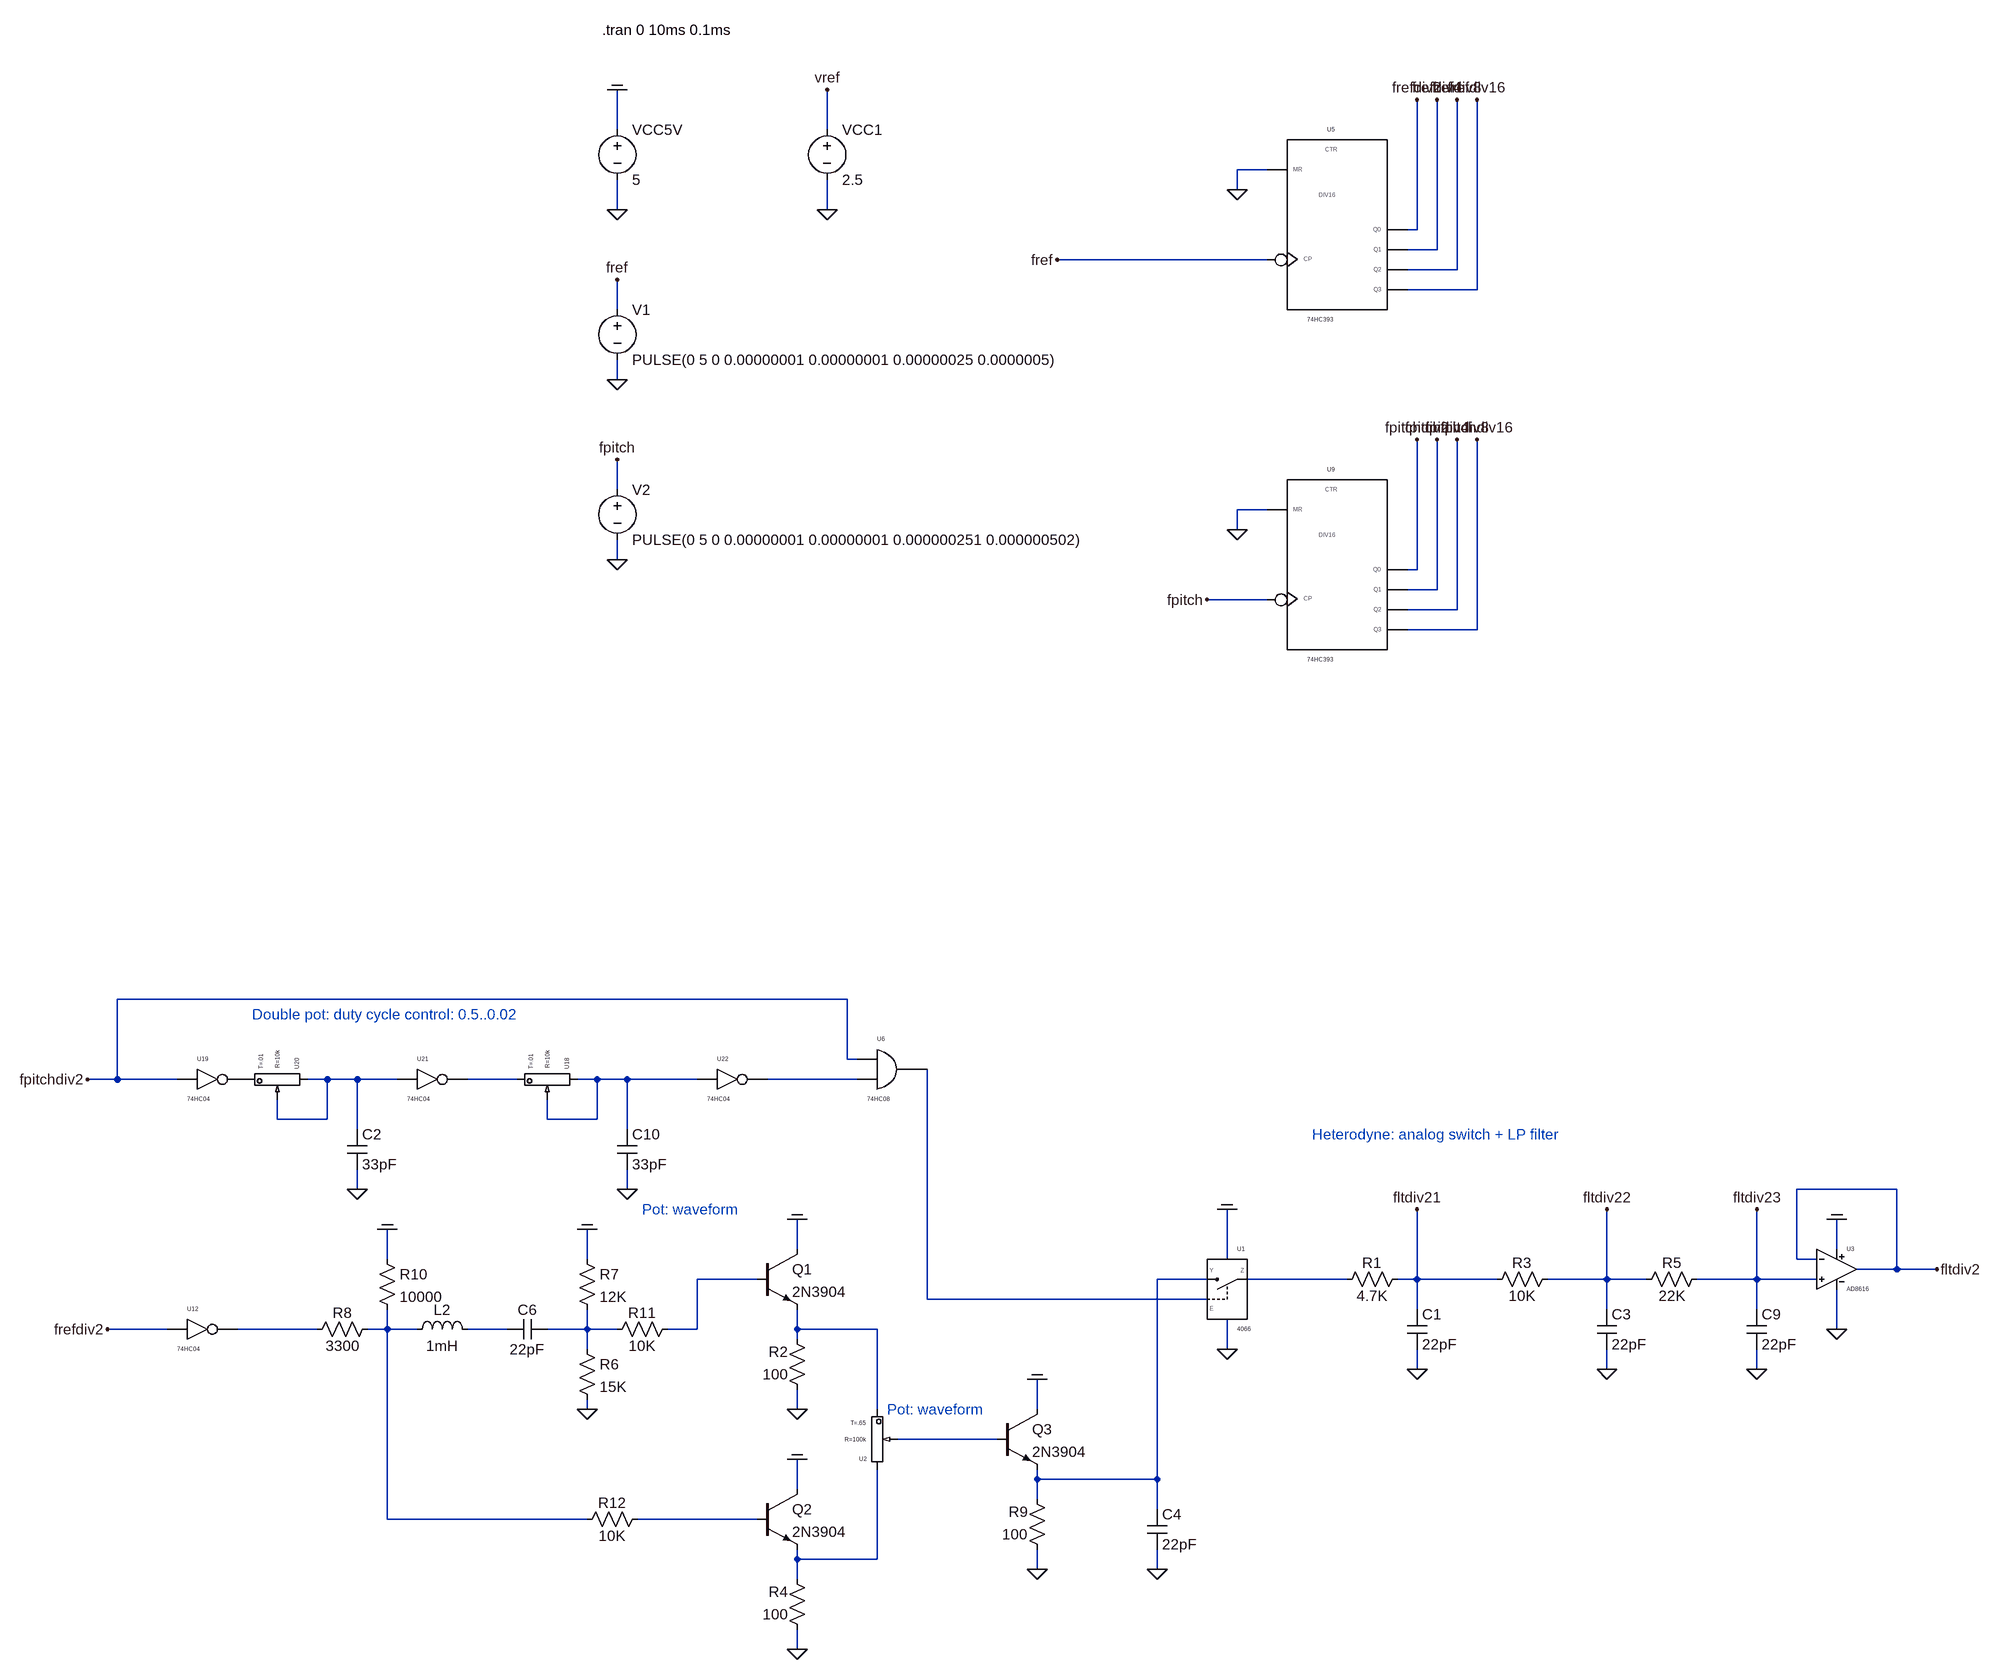
[diagram p0: schematic paradox_mixer_v1.asc]
paradox_mixer_v1.asc, the LTspice schematic file:
Version 4
SHEET 1 880 1476
WIRE -4336 -1264 -4336 -1328
WIRE -4000 -1264 -4000 -1328
WIRE -3296 -1200 -3344 -1200
WIRE -3344 -1168 -3344 -1200
WIRE -4336 -1136 -4336 -1184
WIRE -4000 -1136 -4000 -1184
WIRE -3056 -1104 -3056 -1312
WIRE -3056 -1104 -3072 -1104
WIRE -3024 -1072 -3024 -1312
WIRE -3024 -1072 -3072 -1072
WIRE -3296 -1056 -3632 -1056
WIRE -2992 -1040 -2992 -1312
WIRE -2992 -1040 -3072 -1040
WIRE -2960 -1008 -2960 -1312
WIRE -2960 -1008 -3072 -1008
WIRE -4336 -976 -4336 -1024
WIRE -4336 -864 -4336 -896
WIRE -4336 -688 -4336 -736
WIRE -3296 -656 -3344 -656
WIRE -3344 -624 -3344 -656
WIRE -4336 -576 -4336 -608
WIRE -3056 -560 -3056 -768
WIRE -3056 -560 -3072 -560
WIRE -3024 -528 -3024 -768
WIRE -3024 -528 -3072 -528
WIRE -3296 -512 -3392 -512
WIRE -2992 -496 -2992 -768
WIRE -2992 -496 -3072 -496
WIRE -2960 -464 -2960 -768
WIRE -2960 -464 -3072 -464
WIRE -3968 128 -5136 128
WIRE -3968 224 -3968 128
WIRE -3952 224 -3968 224
WIRE -5136 256 -5136 128
WIRE -5136 256 -5184 256
WIRE -5040 256 -5136 256
WIRE -4800 256 -4832 256
WIRE -4752 256 -4800 256
WIRE -4688 256 -4752 256
WIRE -4496 256 -4576 256
WIRE -4368 256 -4400 256
WIRE -4320 256 -4368 256
WIRE -4208 256 -4320 256
WIRE -3952 256 -4096 256
WIRE -4880 320 -4880 288
WIRE -4800 320 -4800 256
WIRE -4800 320 -4880 320
WIRE -4448 320 -4448 288
WIRE -4368 320 -4368 256
WIRE -4368 320 -4448 320
WIRE -4752 336 -4752 256
WIRE -4320 336 -4320 256
WIRE -4752 432 -4752 400
WIRE -4320 432 -4320 400
WIRE -2288 432 -2448 432
WIRE -4048 528 -4048 480
WIRE -2384 528 -2384 480
WIRE -4704 544 -4704 496
WIRE -4384 544 -4384 496
WIRE -3360 544 -3360 464
WIRE -2448 544 -2448 432
WIRE -2416 544 -2448 544
WIRE -2288 560 -2288 432
WIRE -2288 560 -2352 560
WIRE -2224 560 -2288 560
WIRE -4112 576 -4208 576
WIRE -3392 576 -3472 576
WIRE -3168 576 -3328 576
WIRE -3056 576 -3056 464
WIRE -3056 576 -3088 576
WIRE -2928 576 -3056 576
WIRE -2752 576 -2752 464
WIRE -2752 576 -2848 576
WIRE -2688 576 -2752 576
WIRE -2512 576 -2512 464
WIRE -2512 576 -2608 576
WIRE -2416 576 -2512 576
WIRE -3840 608 -3840 240
WIRE -3392 608 -3840 608
WIRE -3056 624 -3056 576
WIRE -2752 624 -2752 576
WIRE -2512 624 -2512 576
WIRE -5056 656 -5152 656
WIRE -4816 656 -4944 656
WIRE -4704 656 -4704 624
WIRE -4704 656 -4736 656
WIRE -4656 656 -4704 656
WIRE -4512 656 -4576 656
WIRE -4384 656 -4384 624
WIRE -4384 656 -4448 656
WIRE -4336 656 -4384 656
WIRE -4208 656 -4208 576
WIRE -4208 656 -4256 656
WIRE -4048 656 -4048 624
WIRE -3920 656 -4048 656
WIRE -2384 656 -2384 592
WIRE -4048 672 -4048 656
WIRE -4384 688 -4384 656
WIRE -3360 688 -3360 640
WIRE -3056 720 -3056 688
WIRE -2752 720 -2752 688
WIRE -2512 720 -2512 688
WIRE -4384 784 -4384 768
WIRE -4048 784 -4048 752
WIRE -3920 784 -3920 656
WIRE -3664 784 -3664 736
WIRE -3728 832 -3888 832
WIRE -3664 896 -3664 880
WIRE -3472 896 -3472 576
WIRE -3472 896 -3664 896
WIRE -4048 912 -4048 864
WIRE -3664 928 -3664 896
WIRE -3472 944 -3472 896
WIRE -4704 960 -4704 656
WIRE -4384 960 -4704 960
WIRE -4112 960 -4304 960
WIRE -4048 1024 -4048 1008
WIRE -3920 1024 -3920 880
WIRE -3920 1024 -4048 1024
WIRE -3664 1040 -3664 1008
WIRE -3472 1040 -3472 1008
WIRE -4048 1056 -4048 1024
WIRE -4048 1168 -4048 1136
FLAG -4336 -1328 COM
FLAG -4336 -1136 0
FLAG -4336 -1024 fref
FLAG -4336 -864 0
FLAG -4336 -736 fpitch
FLAG -4336 -576 0
FLAG -4000 -1136 0
FLAG -4000 -1328 vref
FLAG -3056 720 0
FLAG -3056 464 fltdiv21
FLAG -2752 720 0
FLAG -2752 464 fltdiv22
FLAG -3344 -1168 0
FLAG -3632 -1056 fref
FLAG -3056 -1312 frefdiv2
FLAG -3024 -1312 frefdiv4
FLAG -2992 -1312 frefdiv8
FLAG -2960 -1312 frefdiv16
FLAG -3344 -624 0
FLAG -3392 -512 fpitch
FLAG -3056 -768 fpitchdiv2
FLAG -3024 -768 fpitchdiv4
FLAG -2992 -768 fpitchdiv8
FLAG -2960 -768 fpitchdiv16
FLAG -5184 256 fpitchdiv2
FLAG -4384 784 0
FLAG -4384 496 COM
FLAG -3360 464 COM
FLAG -3360 688 0
FLAG -2384 656 0
FLAG -2384 480 COM
FLAG -2224 560 fltdiv2
FLAG -5152 656 frefdiv2
FLAG -4752 432 0
FLAG -4048 784 0
FLAG -4048 480 COM
FLAG -4048 1168 0
FLAG -4048 864 COM
FLAG -2512 720 0
FLAG -2512 464 fltdiv23
FLAG -4320 432 0
FLAG -3664 1040 0
FLAG -3664 736 COM
FLAG -4704 496 COM
FLAG -3472 1040 0
SYMBOL voltage -4336 -1280 R0
WINDOW 123 0 0 Left 2
WINDOW 39 0 0 Left 2
SYMATTR InstName VCC5V
SYMATTR Value 5
SYMBOL voltage -4336 -992 R0
WINDOW 123 0 0 Left 2
WINDOW 39 0 0 Left 2
SYMATTR InstName V1
SYMATTR Value PULSE(0 5 0 0.00000001 0.00000001 0.00000025 0.0000005)
SYMBOL voltage -4336 -704 R0
WINDOW 123 0 0 Left 2
WINDOW 39 0 0 Left 2
SYMATTR InstName V2
SYMATTR Value PULSE(0 5 0 0.00000001 0.00000001 0.000000251 0.000000502)
SYMBOL voltage -4000 -1280 R0
WINDOW 123 0 0 Left 2
WINDOW 39 0 0 Left 2
SYMATTR InstName VCC1
SYMATTR Value 2.5
SYMBOL res -3072 560 R90
WINDOW 0 5 56 VBottom 2
WINDOW 3 27 56 VTop 2
SYMATTR InstName R1
SYMATTR Value 4.7K
SYMBOL cap -3072 624 R0
SYMATTR InstName C1
SYMATTR Value 22pF
SYMBOL res -2832 560 R90
WINDOW 0 5 56 VBottom 2
WINDOW 3 27 56 VTop 2
SYMATTR InstName R3
SYMATTR Value 10K
SYMBOL cap -2768 624 R0
SYMATTR InstName C3
SYMATTR Value 22pF
SYMBOL EXTRA\\74HC\\74hc04 -5008 592 R0
SYMATTR InstName U12
SYMBOL ind -4672 672 R270
WINDOW 0 32 56 VTop 2
WINDOW 3 5 56 VBottom 2
SYMATTR InstName L2
SYMATTR Value 1mH
SYMBOL cap -4448 640 R90
WINDOW 0 0 32 VBottom 2
WINDOW 3 32 32 VTop 2
SYMATTR InstName C6
SYMATTR Value 22pF
SYMBOL res -4400 672 R0
SYMATTR InstName R6
SYMATTR Value 15K
SYMBOL res -4400 528 R0
SYMATTR InstName R7
SYMATTR Value 12K
SYMBOL res -4720 640 R90
WINDOW 0 5 56 VBottom 2
WINDOW 3 27 56 VTop 2
SYMATTR InstName R8
SYMATTR Value 3300
SYMBOL Dig_Add\\CD4xxx\\cd4066 -3360 592 R0
SYMATTR InstName U1
SYMBOL EXTRA\\AudioOpamp\\AD\\AD8616 -2384 560 R0
SYMATTR InstName U3
SYMBOL EXTRA\\74HC\\74hc393 -3184 -736 R0
SYMATTR InstName U9
SYMATTR SpiceLine VCC=3.3  SPEED=1.0  TRIPDT=1e-9
SYMBOL EXTRA\\74HC\\74hc393 -3184 -1280 R0
SYMATTR InstName U5
SYMATTR SpiceLine VCC=3.3  SPEED=1.0  TRIPDT=1e-9
SYMBOL 74hc08 -3904 176 R0
SYMATTR InstName U6
SYMBOL EXTRA\\74HC\\74hc04 -4992 192 R0
SYMATTR InstName U19
SYMBOL cap -4768 336 R0
SYMATTR InstName C2
SYMATTR Value 33pF
SYMBOL EXTRA\\Misc\\pot -4880 256 M270
SYMATTR InstName U20
SYMATTR Value2 T=.01
SYMBOL npn -4112 528 R0
SYMATTR InstName Q1
SYMATTR Value 2N3904
SYMBOL res -4032 768 R180
WINDOW 0 31 76 Left 2
WINDOW 3 31 40 Left 2
SYMATTR InstName R2
SYMATTR Value 100
SYMBOL npn -4112 912 R0
SYMATTR InstName Q2
SYMATTR Value 2N3904
SYMBOL res -4032 1152 R180
WINDOW 0 31 76 Left 2
WINDOW 3 31 40 Left 2
SYMATTR InstName R4
SYMATTR Value 100
SYMBOL EXTRA\\Misc\\pot -3920 832 R180
SYMATTR InstName U2
SYMATTR Value R=100k
SYMATTR Value2 T=.65
SYMBOL res -2592 560 R90
WINDOW 0 5 56 VBottom 2
WINDOW 3 27 56 VTop 2
SYMATTR InstName R5
SYMATTR Value 22K
SYMBOL cap -2528 624 R0
SYMATTR InstName C9
SYMATTR Value 22pF
SYMBOL cap -4336 336 R0
SYMATTR InstName C10
SYMATTR Value 33pF
SYMBOL EXTRA\\Misc\\pot -4448 256 M270
SYMATTR InstName U18
SYMATTR Value2 T=.01
SYMBOL EXTRA\\74HC\\74hc04 -4640 192 R0
SYMATTR InstName U21
SYMBOL EXTRA\\74HC\\74hc04 -4160 192 R0
SYMATTR InstName U22
SYMBOL npn -3728 784 R0
SYMATTR InstName Q3
SYMATTR Value 2N3904
SYMBOL res -3648 1024 R180
WINDOW 0 31 76 Left 2
WINDOW 3 31 40 Left 2
SYMATTR InstName R9
SYMATTR Value 100
SYMBOL res -4720 528 R0
SYMATTR InstName R10
SYMATTR Value 10000
SYMBOL cap -3488 944 R0
SYMATTR InstName C4
SYMATTR Value 22pF
SYMBOL res -4352 672 R270
WINDOW 0 27 56 VTop 2
WINDOW 3 5 56 VBottom 2
SYMATTR InstName R11
SYMATTR Value 10K
SYMBOL res -4400 976 R270
WINDOW 0 27 56 VTop 2
WINDOW 3 5 56 VBottom 2
SYMATTR InstName R12
SYMATTR Value 10K
TEXT -4360 -1424 Left 2 !.tran 0 10ms 0.1ms
TEXT -4296 464 Left 2 ;Pot: waveform
TEXT -3224 344 Left 2 ;Heterodyne: analog switch + LP filter
TEXT -3904 784 Left 2 ;Pot: waveform
TEXT -4920 152 Left 2 ;Double pot: duty cycle control: 0.5..0.02

The netlist it stands for:
* paradox_mixer_v1.asc
VCC5V COM 0 5
V1 fref 0 PULSE(0 5 0 0.00000001 0.00000001 0.00000025 0.0000005)
V2 fpitch 0 PULSE(0 5 0 0.00000001 0.00000001 0.000000251 0.000000502)
VCC1 vref 0 2.5
R1 fltdiv21 N007 4.7K
C1 fltdiv21 0 22pF
R3 fltdiv22 fltdiv21 10K
C3 fltdiv22 0 22pF
XU12 frefdiv2 N009 VCC 0 74HC04 VCC=5  SPEED=1.0  TRIPDT=1e-9  ; pins A Y
L2 N010 N011 1mH
C6 N012 N011 22pF
R6 N012 0 15K
R7 COM N012 12K
R8 N010 N009 3300
XU1 N006 N007 N008 COM 0 4066  ; pins Y OUT EN VCC VSS
XU3 fltdiv23 fltdiv2 COM 0 fltdiv2 AD8616  ; pins In+ In- V+ V- OUT
XU9 0 fpitch fpitchdiv2 fpitchdiv4 fpitchdiv8 fpitchdiv16 VCC 0 74HC393 VCC=3.3  SPEED=1.0  TRIPDT=1e-9  ; pins 1MR 1CP 1Q0 1Q1 1Q2 1Q3
XU5 0 fref frefdiv2 frefdiv4 frefdiv8 frefdiv16 VCC 0 74HC393 VCC=3.3  SPEED=1.0  TRIPDT=1e-9  ; pins 1MR 1CP 1Q0 1Q1 1Q2 1Q3
XU6 fpitchdiv2 N004 N008 VCC 0 74HC08 VCC=5  SPEED=1.0  TRIPDT=1e-9  ; pins A B Y
XU19 fpitchdiv2 P001 VCC 0 74HC04 VCC=5  SPEED=1.0  TRIPDT=1e-9  ; pins A Y
C2 N001 0 33pF
XU20 N001 P001 N001 pot R=10k T=.01  ; pins A B C
Q1 COM N005 N013 0 2N3904
R2 0 N013 100
Q2 COM N015 N016 0 2N3904
R4 0 N016 100
XU2 N016 N013 N014 pot R=100k T=.65  ; pins A B C
R5 fltdiv23 fltdiv22 22K
C9 fltdiv23 0 22pF
C10 N003 0 33pF
XU18 N003 N002 N003 pot R=10k T=.01  ; pins A B C
XU21 N001 N002 VCC 0 74HC04 VCC=5  SPEED=1.0  TRIPDT=1e-9  ; pins A Y
XU22 N003 N004 VCC 0 74HC04 VCC=5  SPEED=1.0  TRIPDT=1e-9  ; pins A Y
Q3 COM N014 N006 0 2N3904
R9 0 N006 100
R10 COM N010 10000
C4 N006 0 22pF
R11 N012 N005 10K
R12 N010 N015 10K
.model NPN NPN
.model PNP PNP
.lib standard.bjt
.tran 0 10ms 0.1ms
* Pot: waveform
* Heterodyne: analog switch + LP filter
* Pot: waveform
* Double pot: duty cycle control: 0.5..0.02
.lib 74HC.lib
.lib SwitchAna.lib
.lib AD8616.cir
.lib pot.lib
.backanno
.end